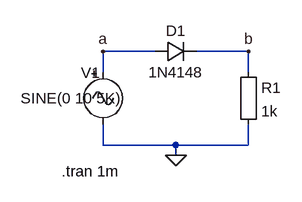
[diagram p0: schematic rectifier.asc]
rectifier.asc, the LTspice schematic file:
Version 4
SHEET 1 880 680
WIRE 16 208 -64 208
WIRE 160 208 80 208
WIRE -64 240 -64 208
WIRE 160 240 160 208
WIRE -64 352 -64 320
WIRE 48 352 -64 352
WIRE 160 352 160 320
WIRE 160 352 48 352
WIRE 48 368 48 352
FLAG -64 208 a
FLAG 160 208 b
FLAG 48 368 0
SYMBOL diode 16 224 R270
WINDOW 0 32 32 VTop 2
WINDOW 3 0 32 VBottom 2
SYMATTR InstName D1
SYMATTR Value 1N4148
SYMBOL Misc\\signal -64 224 R0
WINDOW 123 0 0 Left 2
WINDOW 39 0 0 Left 2
WINDOW 0 -34 17 Left 2
WINDOW 3 -127 56 Left 2
SYMATTR InstName V1
SYMATTR Value SINE(0 10 5K)
SYMBOL Misc\\EuropeanResistor 144 224 R0
SYMATTR InstName R1
SYMATTR Value 1k
TEXT -128 392 Left 2 !.tran 1m

The netlist it stands for:
* rectifier.asc
D1 a b 1N4148
V1 a 0 SINE(0 10 5K)
R1 b 0 1k
.model D D
.lib standard.dio
.tran 1m
.backanno
.end